# EAGLE design lcd_shift_register (EAGLE 6.5.0)
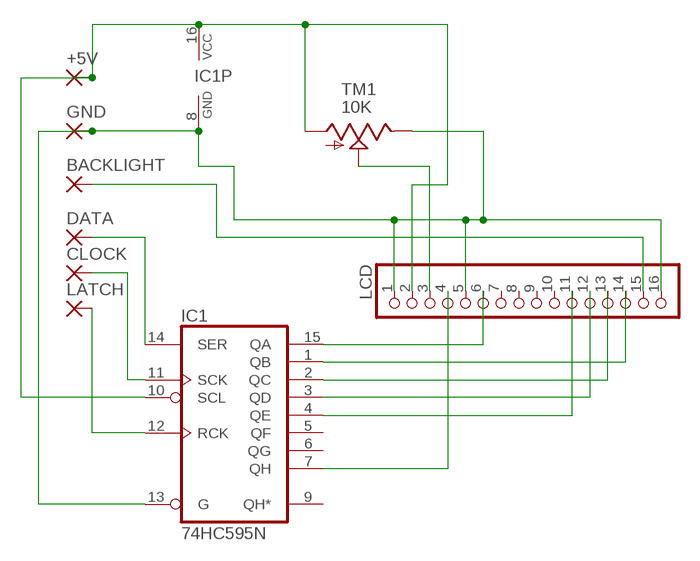
[diagram p0: schematic, sheet 1]

## Parts
+5V  2,15/1,0  [2,15/1,0]
BACKLIGHT  2,15/1,0  [2,15/1,0]
CLOCK  2,15/1,0  [2,15/1,0]
DATA  2,15/1,0  [2,15/1,0]
GND  2,15/1,0  [2,15/1,0]
IC1  74HC595N  [DIL16]
LATCH  2,15/1,0  [2,15/1,0]
LCD  PINHD-1X16  [1X16]
TM1  10K  TRIM  [6MM]

## Nets
N$1: +5V.1(P) IC1.10(SCL) IC1.16(VCC) LCD.2 TM1.A
N$2: GND.1(P) IC1.8(GND) IC1.13(G) LCD.1 LCD.5 LCD.16 TM1.E
N$3: BACKLIGHT.1(P) LCD.15
N$5: LCD.3 TM1.S
N$6: DATA.1(P) IC1.14(SER)
N$7: IC1.12(RCK) LATCH.1(P)
N$8: CLOCK.1(P) IC1.11(SCK)
N$9: IC1.1(QB) LCD.14
N$10: IC1.2(QC) LCD.13
N$11: IC1.3(QD) LCD.12
N$12: IC1.4(QE) LCD.11
N$13: IC1.15(QA) LCD.6
N$14: IC1.7(QH) LCD.4
Unconnected: IC1.5(QF) IC1.6(QG) IC1.9(QH*) LCD.7 LCD.8 LCD.9 LCD.10

## Library data of the parts
+5V BACKLIGHT CLOCK DATA GND LATCH = wirepad:2,15/1,0: THROUGH-HOLE PAD
IC1 = 74xx-eu:74*595: 8-bit SHIFT REGISTER, output latch
LCD = pinhead:PINHD-1X16: PIN HEADER
TM1 = adafruit:TRIM

## Net classes
0 default: clearance 0.205 mm

## Board
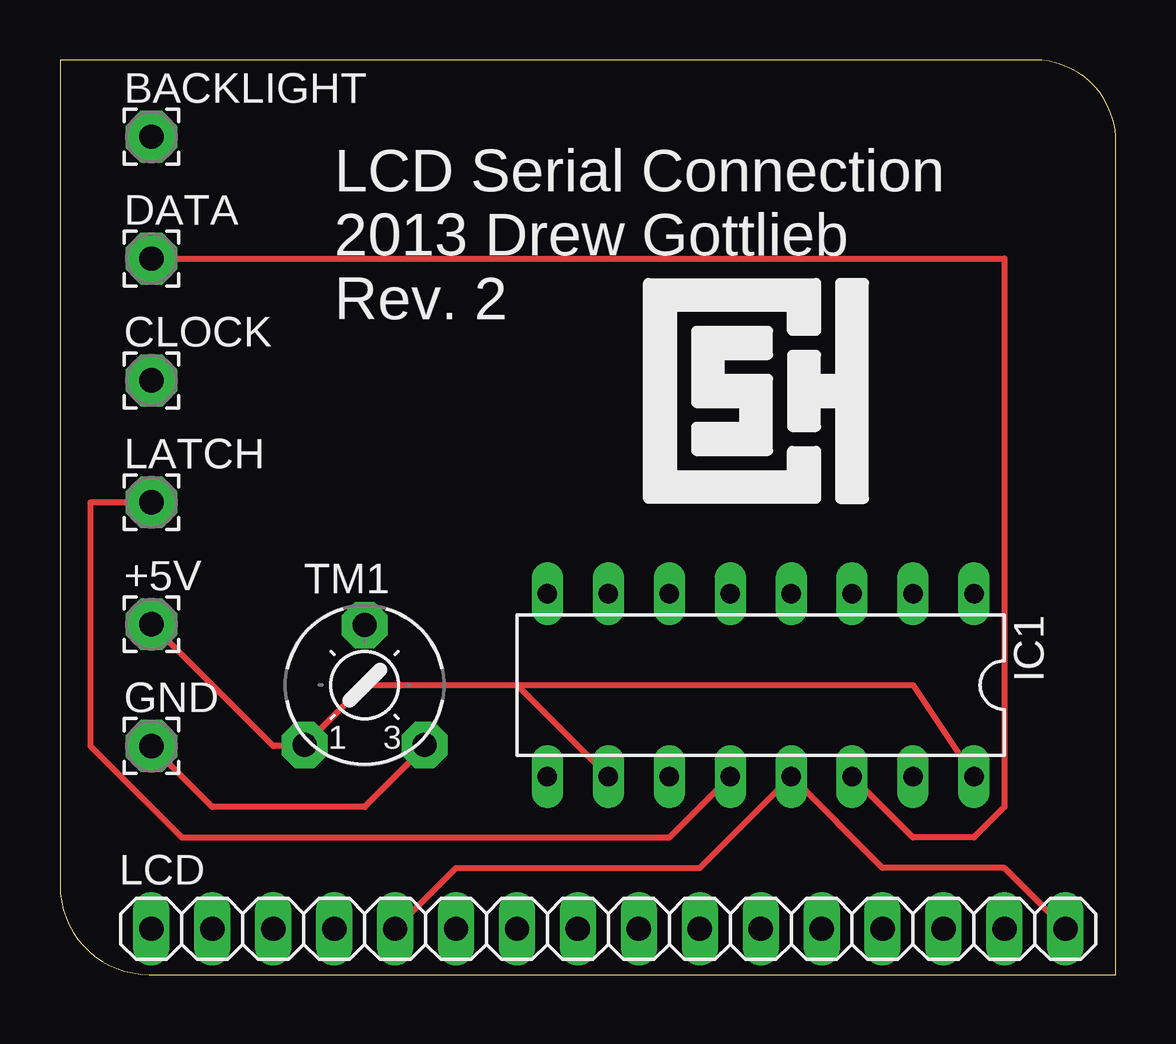
[diagram p1: board, top side]
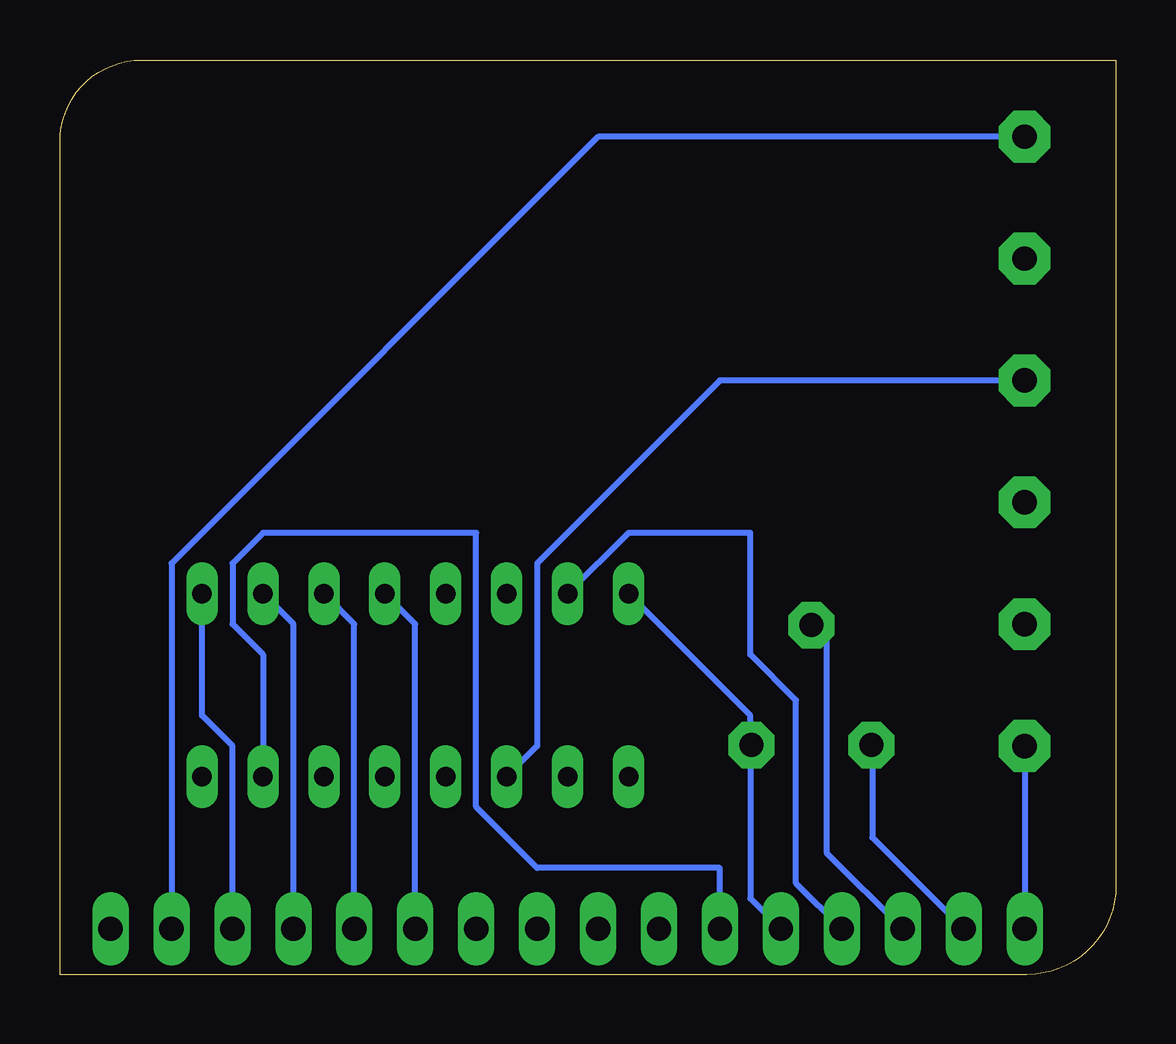
[diagram p2: board, bottom side, seen from below]

Size 44.02 x 38.12 mm. Coordinates in mm from the lower left corner, seen from the top.
Outline: 0,38.12 0,3.71 arc90 3.71,0 44.02,0 44.02,34.73 arc90 40.62,38.12 0,38.12
Copper layers (1*16): Top 0.035mm / dielectric 1.5mm / Bottom 0.035mm
Design rules "default": minimum track width 10mil, minimum drill 24mil, track to track 8mil, track to pad 8mil, pad to pad 8mil, via to via 8mil, smd to smd 8mil, copper to edge 40mil, drill to drill 8mil, minimum pad ring 10mil, minimum via ring 8mil, stop-mask expansion 4mil, vias tented up to drill 0mil, thermal gap 10mil

### Footprints (pad centres in the part's own frame; a part is rotated, then mirrored left to right if it is on the bottom)
2,15/1,0 = drill 1.016 pad 2.159 octagon: 1 0,0
DIL16 = drill 0.813 long: 1 -8.89,-3.81; 2 -6.35,-3.81; 3 -3.81,-3.81; 4 -1.27,-3.81; 5 1.27,-3.81; 6 3.81,-3.81; 7 6.35,-3.81; 8 8.89,-3.81; 9 8.89,3.81; 10 6.35,3.81; 11 3.81,3.81; 12 1.27,3.81; 13 -1.27,3.81; 14 -3.81,3.81; 15 -6.35,3.81; 16 -8.89,3.81
1X16 = drill 1.016 long: 1 -19.05,0; 2 -16.51,0; 3 -13.97,0; 4 -11.43,0; 5 -8.89,0; 6 -6.35,0; 7 -3.81,0; 8 -1.27,0; 9 1.27,0; 10 3.81,0; 11 6.35,0; 12 8.89,0; 13 11.43,0; 14 13.97,0; 15 16.51,0; 16 19.05,0
6MM = drill 1 pad 1.93 octagon: A -2.5,-2.5; E 2.5,-2.5; S 0,2.5

### Placement (x,y rotation side)
+5V  3.81,14.6 0 top
BACKLIGHT  3.81,34.93 0 top
CLOCK  3.81,24.77 0 top
DATA  3.81,29.84 0 top
GND  3.81,9.52 0 top
IC1  29.21,12.06 180 top
LATCH  3.81,19.68 0 top
LCD  22.86,1.91 0 top
TM1  12.7,12.06 0 top

### Tracks (layer width: path | path; a pad name or v marks a point on that pad's centre or on a via)
N$1
  Top 0.254: 19.05,12.06 IC1.10 | 19.05,12.06 12.7,12.06 TM1.A 10.16,9.52 8.89,9.52 +5V.1 | IC1.16 35.56,12.06 19.05,12.06
  Bottom 0.254: LCD.2 10.16,5.71 10.16,9.52 TM1.A
N$2
  Top 0.254: LCD.16 39.37,4.45 34.29,4.45 IC1.13 26.67,4.45 16.51,4.45 LCD.5 | GND.1 6.35,6.99 12.7,6.99 15.24,9.52 TM1.E
  Bottom 0.254: GND.1 LCD.1 | IC1.8 15.24,10.79 15.24,9.52 | LCD.5 15.24,3.18 15.24,9.52 | 15.24,9.52 TM1.E
N$3
  Bottom 0.254: LCD.15 39.37,17.14 21.59,34.93 BACKLIGHT.1
N$5
  Bottom 0.254: LCD.3 12.06,5.08 12.06,13.97 TM1.S 12.7,14.6
N$6
  Top 0.254: IC1.14 35.56,5.71 38.1,5.71 39.37,6.99 39.37,29.84 DATA.1
N$7
  Top 0.254: IC1.12 25.4,5.71 5.08,5.71 1.27,9.52 1.27,19.68 LATCH.1
N$8
  Bottom 0.254: IC1.11 24.13,9.52 24.13,17.14 16.51,24.77 CLOCK.1
N$9
  Bottom 0.254: IC1.1 38.1,10.79 36.83,9.52 LCD.14
N$10
  Bottom 0.254: IC1.2 34.29,14.6 LCD.13
N$11
  Bottom 0.254: IC1.3 31.75,14.6 LCD.12
N$12
  Bottom 0.254: IC1.4 29.21,14.6 LCD.11
N$13
  Bottom 0.254: IC1.15 35.56,13.33 36.83,14.6 36.83,17.14 35.56,18.41 26.67,18.41 26.67,6.99 24.13,4.45 16.51,4.45 LCD.6
N$14
  Bottom 0.254: IC1.7 20.32,18.41 15.24,18.41 15.24,13.33 13.33,11.43 13.33,3.81 LCD.4

### Text on the board
tNames: LCD Serial Connection / 2013 Drew Gottlieb / Rev. 2